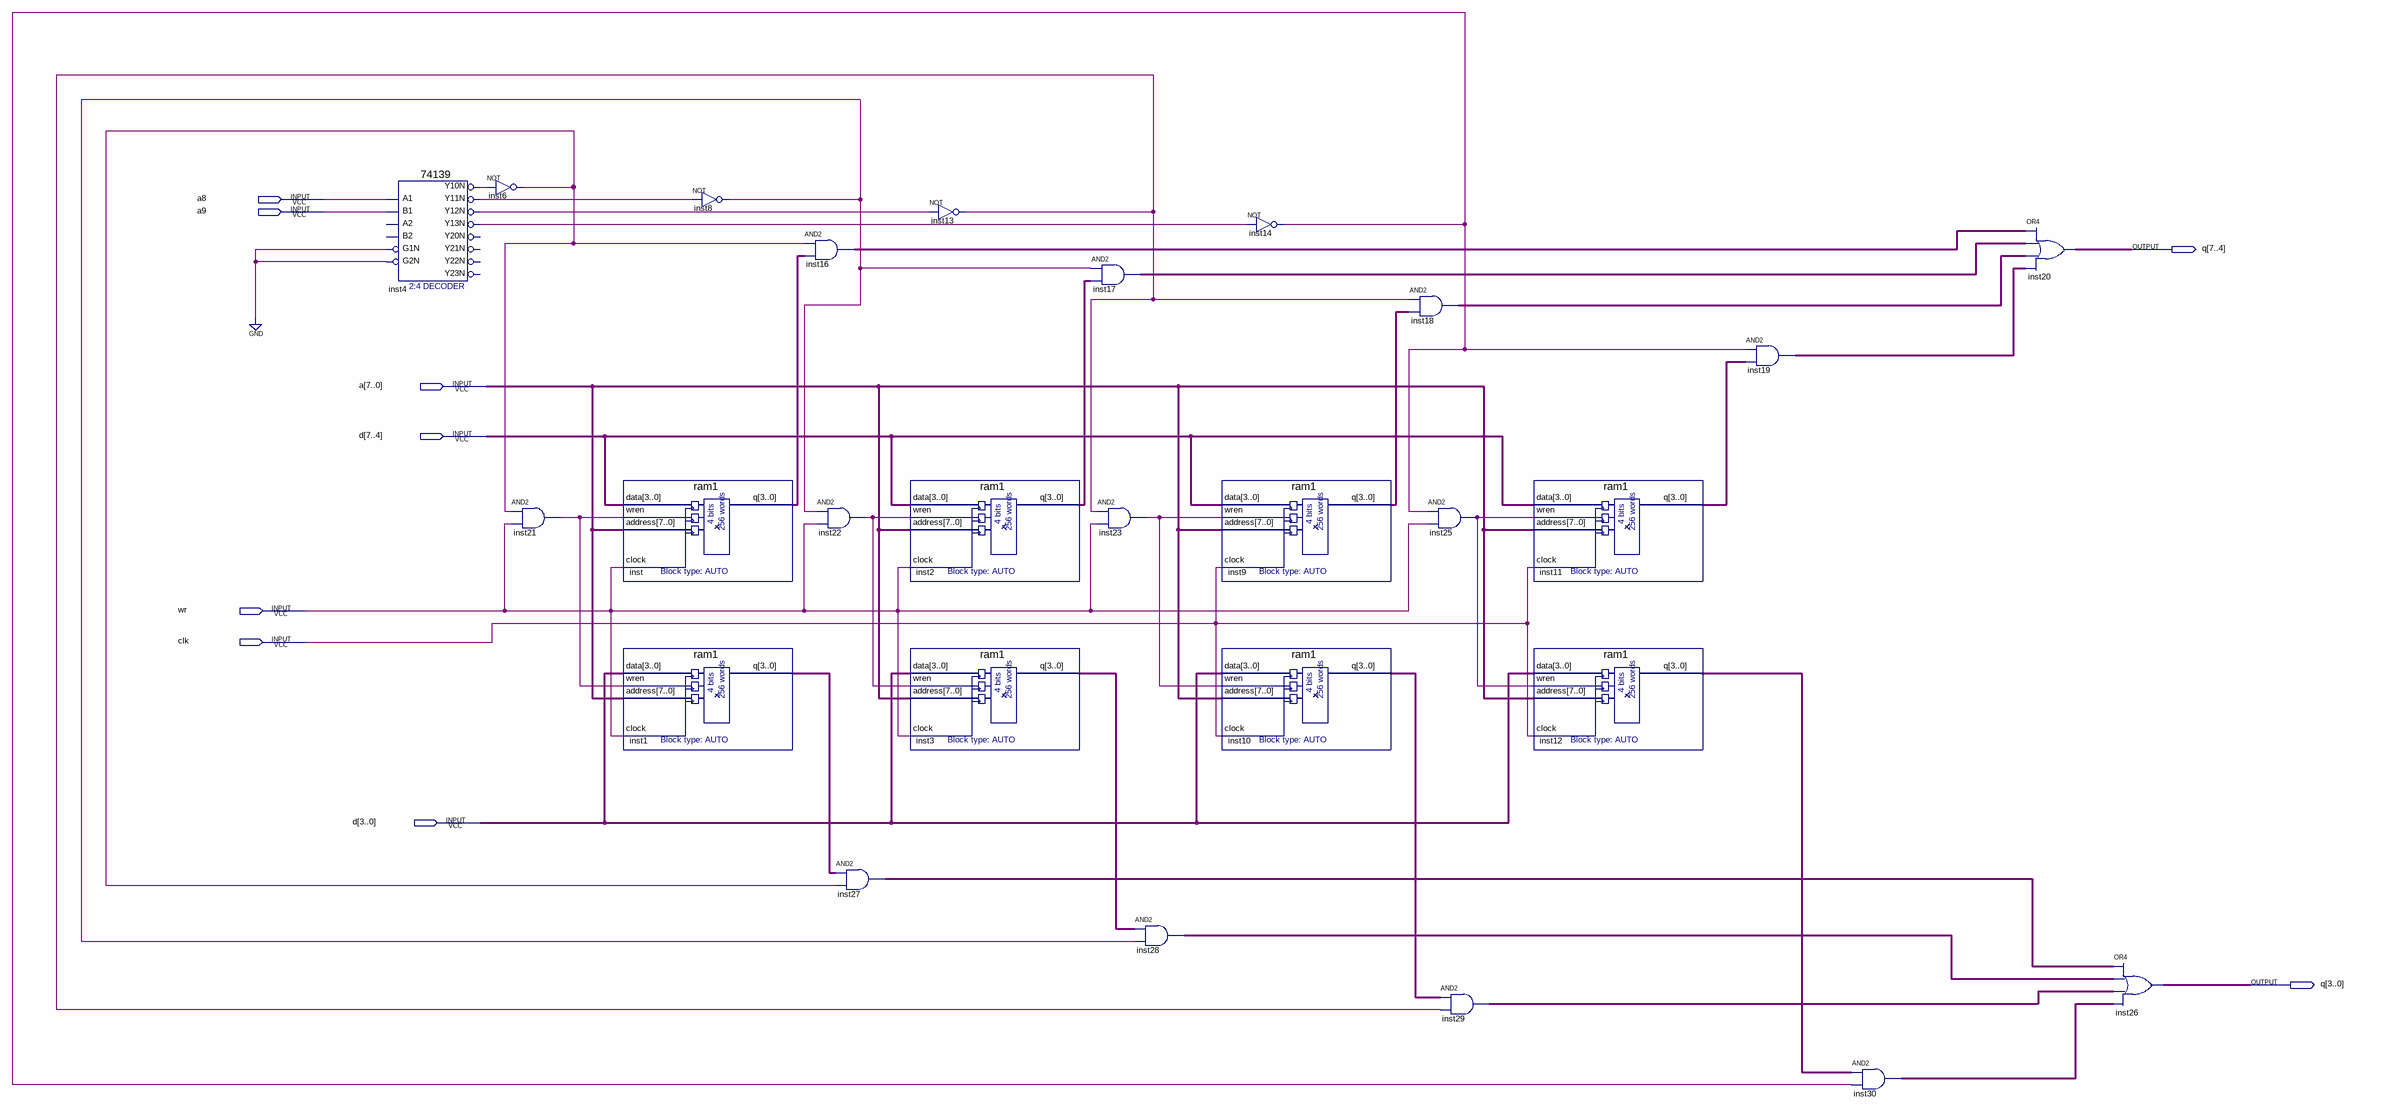
[diagram p0: schematic sheet]
// Quartus schematic 9.bdf as structural Verilog: 27 symbols, 9 pins
module \9  (
  input  a8,
  input  a9,
  input  [7:0] a,
  input  [7:0] d,
  input  wr,
  input  clk,
  output [7:0] q
);

  wire inst4_y10n, inst4_y11n, inst4_y12n, inst4_y13n, inst6_out, inst8_out, inst13_out, inst14_out,
       inst21_out, inst22_out, inst23_out, inst25_out;
  wire [3:0] inst1_q, inst2_q, inst3_q, inst9_q, inst10_q, inst11_q, inst12_q, inst16_out, inst17_out,
       inst18_out, inst19_out, inst27_out, inst28_out, inst29_out, inst30_out, inst_q;

  \74139  inst4 (
    .A1(a8), .B1(a9), .G1N(1'b0), .G2N(1'b0), .Y10N(inst4_y10n), .Y13N(inst4_y13n), .Y12N(inst4_y12n),
    .Y11N(inst4_y11n));  // open: A2, B2, Y20N, Y21N, Y22N, Y23N
  not inst6 (inst6_out, inst4_y10n);
  and inst21 (inst21_out, inst6_out, wr);
  ram1 inst (.data(d[7:4]), .wren(inst21_out), .address(a), .clock(wr), .q(inst_q));
  ram1 inst1 (.data(d[3:0]), .wren(inst21_out), .address(a), .clock(wr), .q(inst1_q));
  not inst8 (inst8_out, inst4_y11n);
  assign inst16_out = {4{inst6_out}} & inst_q;  // AND2 inst16, 4 bits wide
  and inst22 (inst22_out, inst8_out, wr);
  assign inst27_out = inst1_q & {4{inst6_out}};  // AND2 inst27, 4 bits wide
  not inst13 (inst13_out, inst4_y12n);
  ram1 inst2 (.data(d[7:4]), .wren(inst22_out), .address(a), .clock(wr), .q(inst2_q));
  ram1 inst3 (.data(d[3:0]), .wren(inst22_out), .address(a), .clock(wr), .q(inst3_q));
  assign inst17_out = {4{inst8_out}} & inst2_q;  // AND2 inst17, 4 bits wide
  and inst23 (inst23_out, inst13_out, wr);
  assign inst28_out = inst3_q & {4{inst8_out}};  // AND2 inst28, 4 bits wide
  ram1 inst9 (.data(d[7:4]), .wren(inst23_out), .address(a), .clock(clk), .q(inst9_q));
  ram1 inst10 (.data(d[3:0]), .wren(inst23_out), .address(a), .clock(clk), .q(inst10_q));
  not inst14 (inst14_out, inst4_y13n);
  assign inst18_out = {4{inst13_out}} & inst9_q;  // AND2 inst18, 4 bits wide
  and inst25 (inst25_out, inst14_out, wr);
  assign inst29_out = inst10_q & {4{inst13_out}};  // AND2 inst29, 4 bits wide
  ram1 inst11 (.data(d[7:4]), .wren(inst25_out), .address(a), .clock(clk), .q(inst11_q));
  ram1 inst12 (.data(d[3:0]), .wren(inst25_out), .address(a), .clock(clk), .q(inst12_q));
  assign inst19_out = {4{inst14_out}} & inst11_q;  // AND2 inst19, 4 bits wide
  assign inst30_out = inst12_q & {4{inst14_out}};  // AND2 inst30, 4 bits wide
  assign q[7:4] = inst16_out | inst17_out | inst18_out | inst19_out;  // OR4 inst20, 4 bits wide
  assign q[3:0] = inst27_out | inst28_out | inst29_out | inst30_out;  // OR4 inst26, 4 bits wide
endmodule
